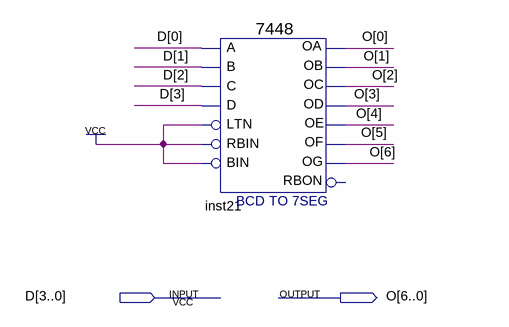
[diagram p0: schematic sheet]
// Quartus schematic 7448pro.bdf as structural Verilog: 1 symbols, 2 pins
module \7448pro  (
  input  [3:0] D,
  output [6:0] O
);

  \7448  inst21 (
    .A(D[0]), .C(D[2]), .D(D[3]), .B(D[1]), .RBIN(1'b1), .BIN(1'b1), .LTN(1'b1), .OC(O[2]), .OE(O[4]),
    .OD(O[3]), .OF(O[5]), .OG(O[6]), .OB(O[1]), .OA(O[0]));  // open: RBON
endmodule
